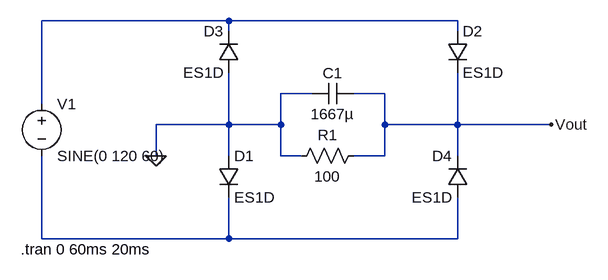
[diagram p0: schematic FullwaveRectifier_RC_Filter.asc]
FullwaveRectifier_RC_Filter.asc, the LTspice schematic file:
Version 4
SHEET 1 880 680
WIRE 192 -16 -96 -16
WIRE 544 -16 192 -16
WIRE 192 0 192 -16
WIRE 544 0 544 -16
WIRE 320 96 272 96
WIRE 432 96 384 96
WIRE -96 112 -96 -16
WIRE 192 144 192 64
WIRE 192 144 80 144
WIRE 272 144 272 96
WIRE 272 144 192 144
WIRE 432 144 432 96
WIRE 544 144 544 64
WIRE 544 144 432 144
WIRE 688 144 544 144
WIRE 80 192 80 144
WIRE 192 192 192 144
WIRE 272 192 272 144
WIRE 304 192 272 192
WIRE 432 192 432 144
WIRE 432 192 384 192
WIRE 544 192 544 144
WIRE -96 320 -96 192
WIRE 192 320 192 256
WIRE 192 320 -96 320
WIRE 544 320 544 256
WIRE 544 320 192 320
FLAG 80 192 0
FLAG 688 144 Vout
SYMBOL diode 176 192 R0
SYMATTR InstName D1
SYMATTR Value ES1D
SYMBOL diode 528 0 R0
SYMATTR InstName D2
SYMATTR Value ES1D
SYMBOL diode 208 64 R180
WINDOW 0 24 64 Left 2
WINDOW 3 24 0 Left 2
SYMATTR InstName D3
SYMATTR Value ES1D
SYMBOL diode 560 256 R180
WINDOW 0 24 64 Left 2
WINDOW 3 24 0 Left 2
SYMATTR InstName D4
SYMATTR Value ES1D
SYMBOL cap 384 80 R90
WINDOW 0 0 32 VBottom 2
WINDOW 3 32 32 VTop 2
SYMATTR InstName C1
SYMATTR Value 1667µ
SYMBOL res 400 176 R90
WINDOW 0 0 56 VBottom 2
WINDOW 3 32 56 VTop 2
SYMATTR InstName R1
SYMATTR Value 100
SYMBOL voltage -96 96 R0
WINDOW 123 0 0 Left 0
WINDOW 39 0 0 Left 0
SYMATTR InstName V1
SYMATTR Value SINE(0 120 60)
TEXT -128 336 Left 2 !.tran 0 60ms 20ms

The netlist it stands for:
* FullwaveRectifier_RC_Filter.asc
D1 0 N002 ES1D
D2 N001 Vout ES1D
D3 0 N001 ES1D
D4 N002 Vout ES1D
C1 Vout 0 1667µ
R1 Vout 0 100
V1 N001 N002 SINE(0 120 60)
.model D D
.lib standard.dio
.tran 0 60ms 20ms
.backanno
.end